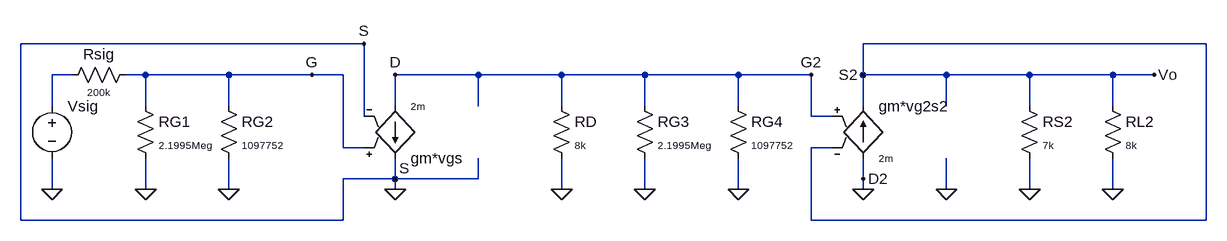
[diagram p0: schematic nmos_small_signal_WithSourceFollower.asc]
nmos_small_signal_WithSourceFollower.asc, the LTspice schematic file:
Version 4
SHEET 1 1684 680
WIRE 384 16 -144 16
WIRE 1680 16 1152 16
WIRE -64 64 -96 64
WIRE 48 64 16 64
WIRE 176 64 48 64
WIRE 304 64 176 64
WIRE 352 64 304 64
WIRE 560 64 432 64
WIRE 688 64 560 64
WIRE 816 64 688 64
WIRE 960 64 816 64
WIRE 1072 64 960 64
WIRE 1152 64 1152 16
WIRE 1280 64 1152 64
WIRE 1408 64 1280 64
WIRE 1536 64 1408 64
WIRE 1600 64 1536 64
WIRE -96 112 -96 64
WIRE 48 112 48 64
WIRE 176 112 176 64
WIRE 432 112 432 64
WIRE 560 112 560 64
WIRE 688 112 688 64
WIRE 816 112 816 64
WIRE 960 112 960 64
WIRE 1152 112 1152 64
WIRE 1280 112 1280 64
WIRE 1408 112 1408 64
WIRE 1536 112 1536 64
WIRE 384 128 384 16
WIRE 1072 128 1072 64
WIRE 1104 128 1072 128
WIRE 352 176 352 64
WIRE 384 176 352 176
WIRE 1104 176 1072 176
WIRE 432 224 432 192
WIRE 432 224 352 224
WIRE 560 224 560 192
WIRE 560 224 432 224
WIRE 1152 224 1152 192
WIRE -96 240 -96 192
WIRE 48 240 48 192
WIRE 176 240 176 192
WIRE 432 240 432 224
WIRE 688 240 688 192
WIRE 816 240 816 192
WIRE 960 240 960 192
WIRE 1152 240 1152 224
WIRE 1280 240 1280 192
WIRE 1408 240 1408 192
WIRE 1536 240 1536 192
WIRE -144 288 -144 16
WIRE 352 288 352 224
WIRE 352 288 -144 288
WIRE 1072 288 1072 176
WIRE 1680 288 1680 16
WIRE 1680 288 1072 288
FLAG -96 240 0
FLAG 48 240 0
FLAG 176 240 0
FLAG 432 240 0
FLAG 688 240 0
FLAG 432 64 D
FLAG 304 64 G
FLAG 432 224 S
FLAG 384 16 S
FLAG 816 240 0
FLAG 960 240 0
FLAG 1152 240 0
FLAG 1280 240 0
FLAG 1408 240 0
FLAG 1536 240 0
FLAG 1600 64 Vo
FLAG 1072 64 G2
FLAG 1152 224 D2
FLAG 1152 64 S2
SYMBOL voltage -96 96 R0
WINDOW 3 24 96 Invisible 2
SYMATTR InstName Vsig
SYMBOL res 32 96 R0
WINDOW 3 36 76 Left 1
SYMATTR Value 2.1995Meg
SYMATTR InstName RG1
SYMBOL res 160 96 R0
WINDOW 3 36 76 Left 1
SYMATTR Value 1097752
SYMATTR InstName RG2
SYMBOL res 672 96 R0
WINDOW 3 36 76 Left 1
SYMATTR Value 8k
SYMATTR InstName RD
SYMBOL res 32 48 R90
WINDOW 0 0 56 VBottom 2
WINDOW 3 32 56 VTop 1
SYMATTR InstName Rsig
SYMATTR Value 200k
SYMBOL g 432 208 M180
WINDOW 3 24 96 Left 1
SYMATTR Value 2m
SYMATTR InstName gm*vgs
SYMBOL res 800 96 R0
WINDOW 3 36 76 Left 1
SYMATTR InstName RG3
SYMATTR Value 2.1995Meg
SYMBOL res 944 96 R0
WINDOW 3 36 76 Left 1
SYMATTR InstName RG4
SYMATTR Value 1097752
SYMBOL g 1152 96 R0
WINDOW 3 24 96 Left 1
SYMATTR InstName gm*vg2s2
SYMATTR Value 2m
SYMBOL res 1392 96 R0
WINDOW 3 36 76 Left 1
SYMATTR InstName RS2
SYMATTR Value 7k
SYMBOL res 1520 96 R0
WINDOW 3 36 76 Left 1
SYMATTR InstName RL2
SYMATTR Value 8k

The netlist it stands for:
* nmos_small_signal_WithSourceFollower.asc
Vsig N001 0 V
RG1 G 0 2.1995Meg
RG2 G 0 1097752
RD G2 0 8k
Rsig G N001 200k
gm*vgs G2 0 G 0 2m
RG3 G2 0 2.1995Meg
RG4 G2 0 1097752
gm*vg2s2 0 S2 G2 S2 2m
RS2 S2 0 7k
RL2 S2 0 8k
.backanno
.end